# EAGLE design led-light (EAGLE 6.4)
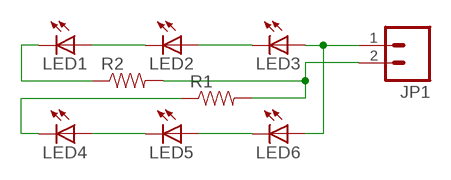
[diagram p0: schematic, sheet 1]

## Parts
JP1  M02PTH  [1X02]
LED1  LED5MM  [LED5MM]
LED2  LED5MM  [LED5MM]
LED3  LED5MM  [LED5MM]
LED4  LED5MM  [LED5MM]
LED5  LED5MM  [LED5MM]
LED6  LED5MM  [LED5MM]
R1  RESISTORPTH-1/4W  [AXIAL-0.4]
R2  RESISTORPTH-1/4W  [AXIAL-0.4]

## Nets
N$1: LED1.K(C) R2.P$1
N$2: LED2.A LED3.K(C)
N$3: LED1.A LED2.K(C)
N$4: LED4.K(C) R1.P$1
N$5: LED4.A LED5.K(C)
N$6: LED5.A LED6.K(C)
N$8: JP1.1 LED3.A LED6.A
N$9: JP1.2 R1.P$2 R2.P$2

## Library data of the parts
JP1 = SparkFun-Connectors:M02: Header 2 Standard 2-pin 0.1" header. Use with straight break away headers (SKU : PRT-00116), right angle break away headers (PRT-00553), swiss pins (PRT-00743), machine pins (PRT-00117), and female headers (PRT-00115). Molex polarized connector foot print use with SKU : PRT-08233 with associated crimp pins and housings.
LED1-LED6 = SparkFun-LED:LED: LEDs Standard schematic elements and footprints for 5mm, 3mm, 1206, and 0603 sized LEDs. 5mm - Spark Fun Electronics SKU : COM-00529 (and others)
R1 R2 = SparkFun-Passives:RESISTOR: Resistor Basic schematic elements and footprints for 0603, 1206, and PTH resistors.

## Board
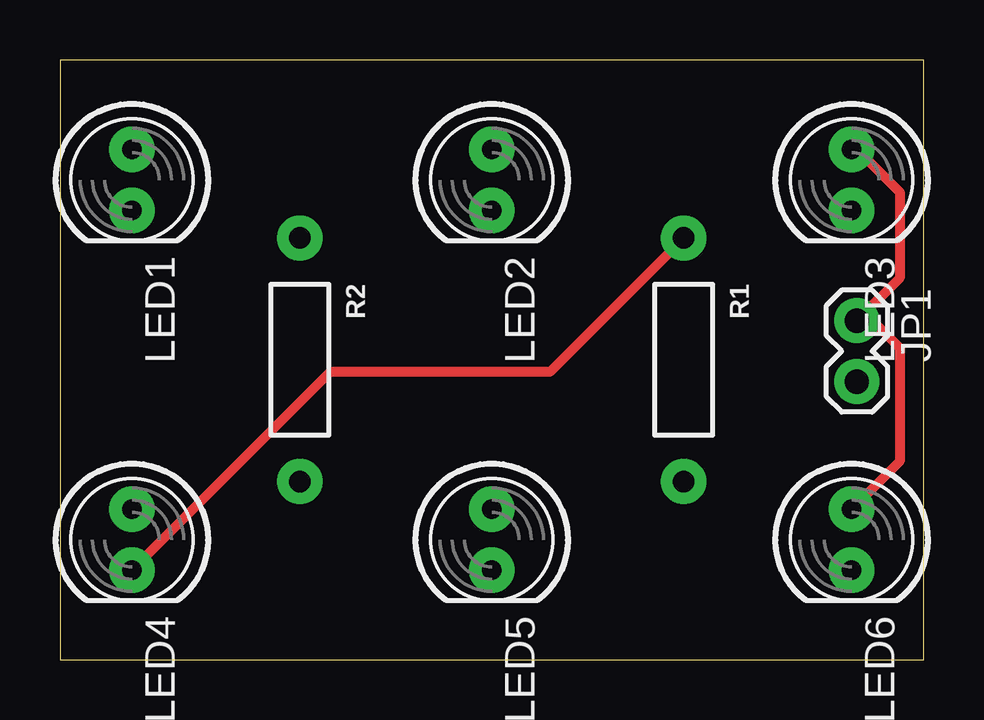
[diagram p1: board, top side]
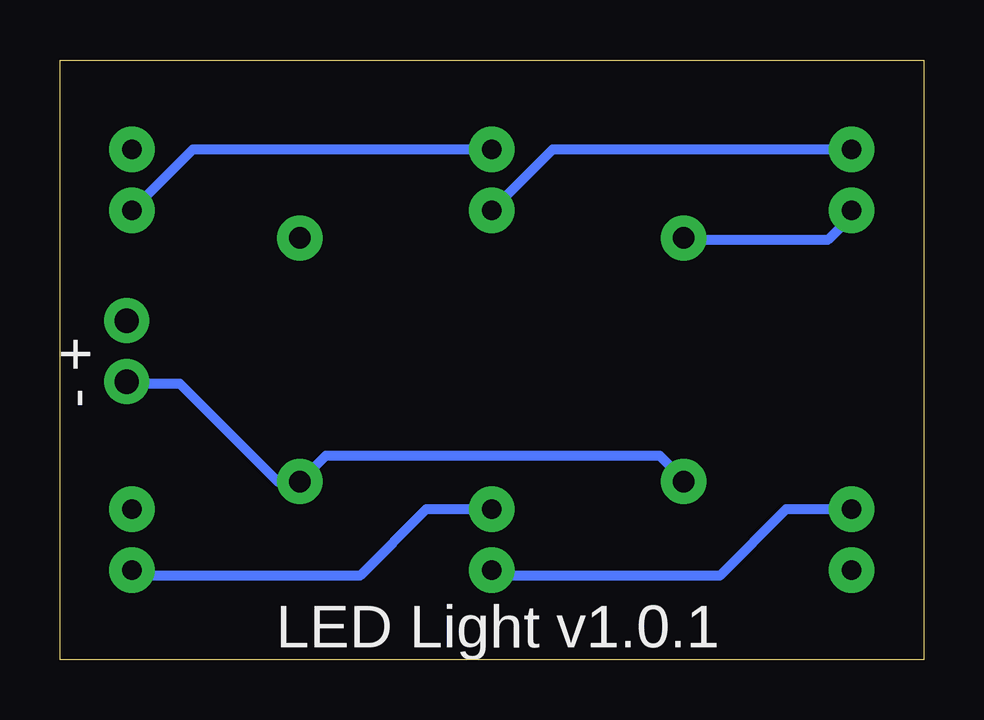
[diagram p2: board, bottom side, seen from below]

Size 36 x 25 mm. Coordinates in mm from the lower left corner, seen from the top.
Outline: 0,0 36,0 36,25 0,25 0,0
Copper layers (1*16): Top 0.0356mm / dielectric 1.5011mm / Bottom 0.0356mm
Design rules "LaenPCBOrder": minimum track width 6mil, minimum drill 13mil, track to track 6mil, track to pad 6mil, pad to pad 6mil, via to via 6mil, smd to smd 6mil, copper to edge 15mil, drill to drill 6mil, minimum pad ring 7mil, minimum via ring 7mil, stop-mask expansion 4mil, vias tented up to drill 0mil, thermal gap 10mil

### Footprints (pad centres in the part's own frame; a part is rotated, then mirrored left to right if it is on the bottom)
1X02 = drill 1.016 pad 1.88: 1 0,0; 2 2.54,0
LED5MM = drill 0.813 pad 1.88: A -1.27,0; K 1.27,0
AXIAL-0.4 = drill 0.9 pad 1.88: P$1 -5.08,0; P$2 5.08,0

### Placement (x,y rotation side)
JP1  33.22,14.13 270 top
LED1  3,20 270 top
LED2  18,20 270 top
LED3  33,20 270 top
LED4  3,5 270 top
LED5  18,5 270 top
LED6  33,5 270 top
R1  26,12.5 270 top
R2  10,12.5 270 top

### Tracks (layer width: path | path; a pad name or v marks a point on that pad's centre or on a via)
N$1
  Bottom 0.406: LED1.K 3,18.5 4,17.5 9.92,17.5 R2.P$1
N$2
  Bottom 0.406: LED2.A 30.46,21.27 LED3.K
N$3
  Bottom 0.406: LED1.A 15.46,21.27 LED2.K
N$4
  Top 0.406: R1.P$1 20.42,12 11.27,12 LED4.K
N$5
  Bottom 0.406: LED4.A 5.73,6.27 8.5,3.5 17.77,3.5 LED5.K
N$6
  Bottom 0.406: LED5.A 20.73,6.27 23.5,3.5 32.77,3.5 LED6.K
N$8
  Top 0.406: LED3.A 33.23,21.27 35,19.5 35,15.91 JP1.1 33.87,14.13 35,13 35,8.27 LED6.A
N$9
  Bottom 0.406: JP1.2 33.13,11.5 31,11.5 26.92,7.42 R1.P$2 24.92,8.5 11,8.5 10,7.5 R2.P$2

### Text on the board
bPlace: - + | LED Light v1.0.1